# EAGLE schematic pcb_full (EAGLE 9.6.2)
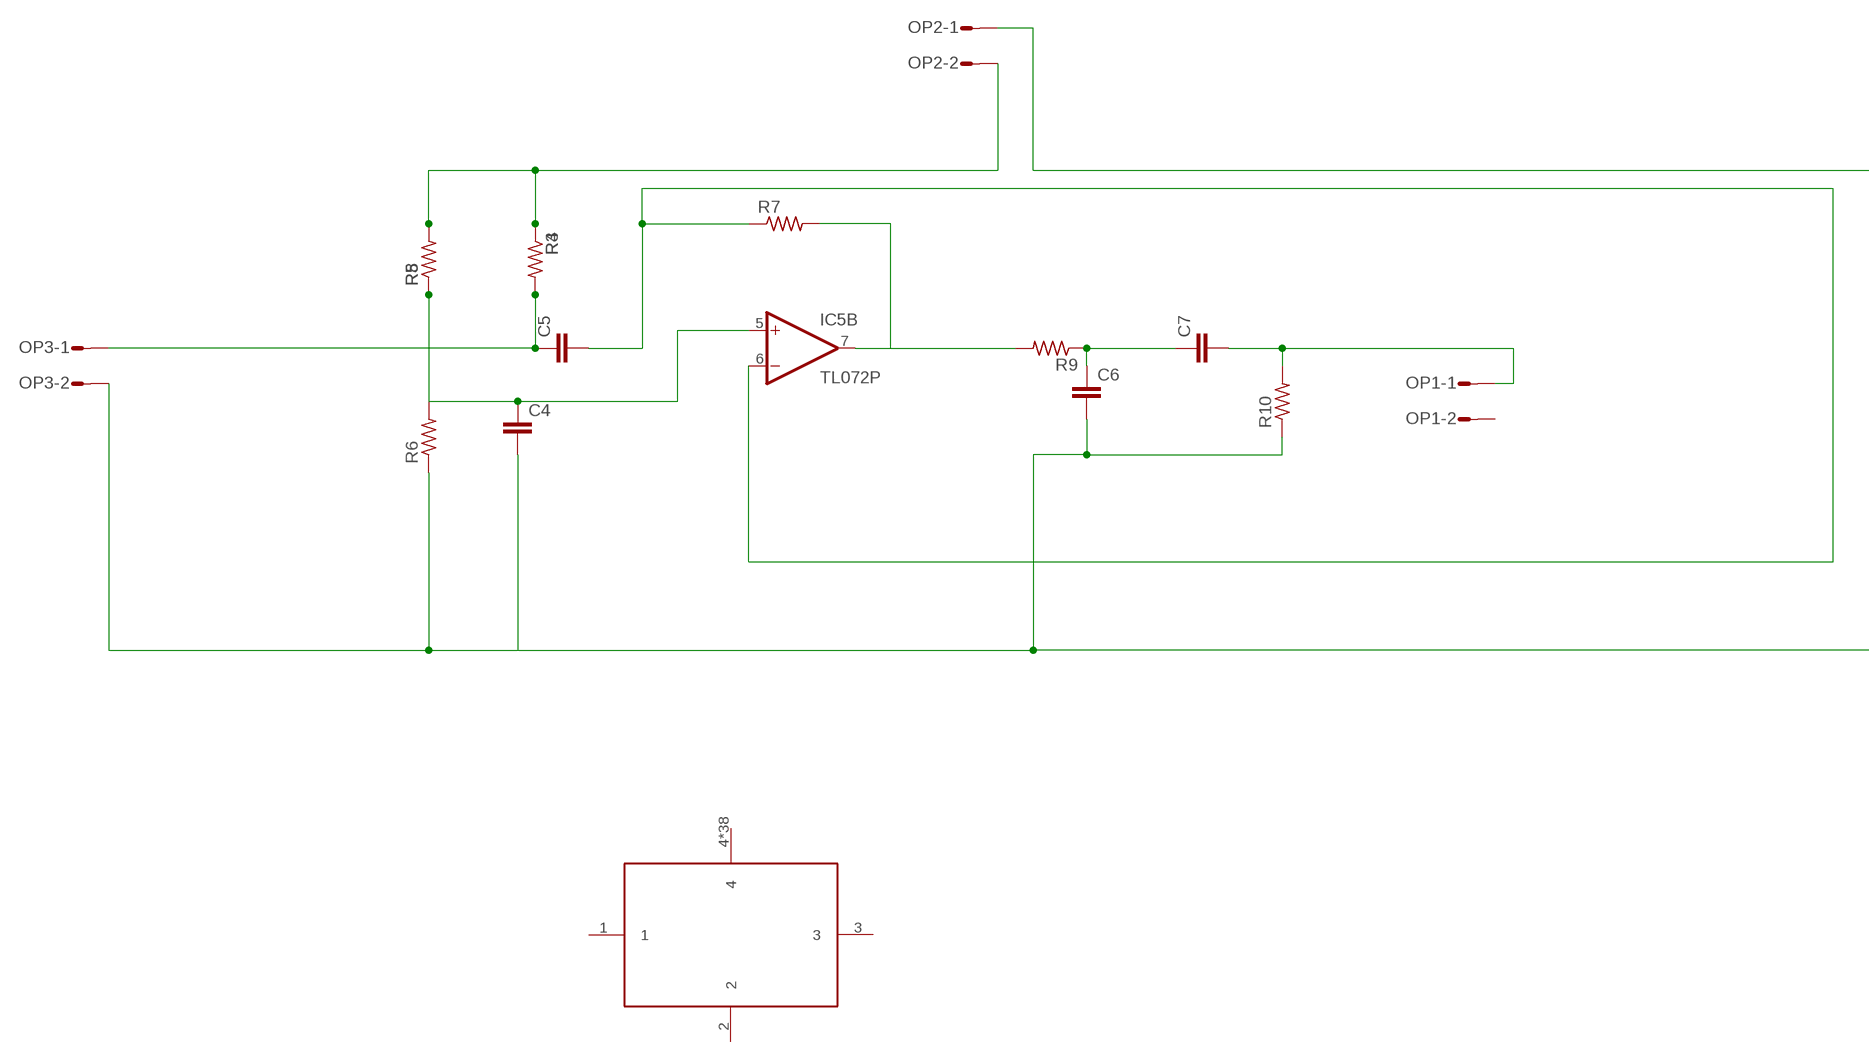
[diagram p0: schematic, sheet 1, part 1 of 2]
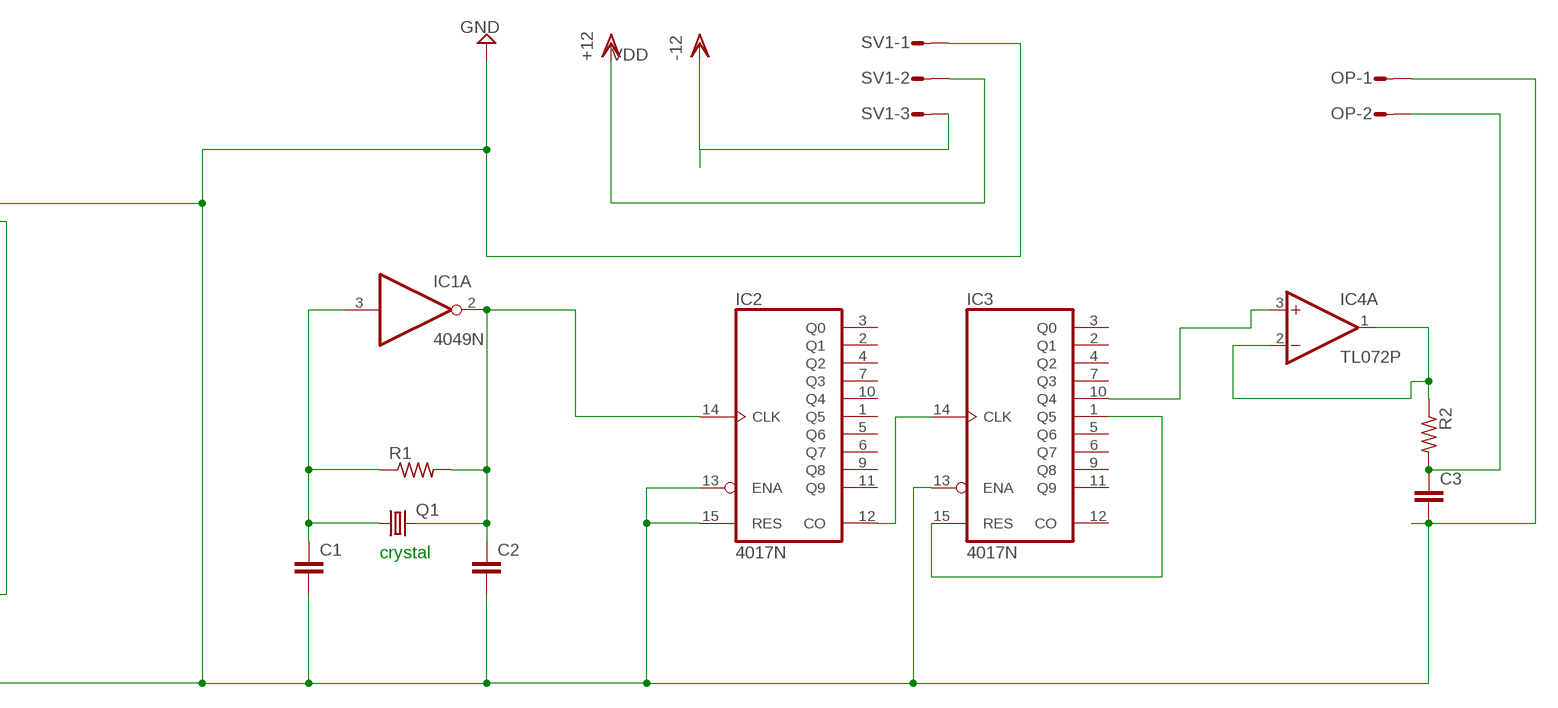
[diagram p1: schematic, sheet 1, part 2 of 2]

## Parts
C1  C5/3.5  [C5B3.5]
C2  C5/3.5  [C5B3.5]
C3  C5/3.5  [C5B3.5]
C4  C5/3.5  [C5B3.5]
C5  C5/3.5  [C5B3.5]
C6  C5/3.5  [C5B3.5]
C7  C5/3.5  [C5B3.5]
IC1  4049N  [DIL16]
IC2  4017N  [DIL16]
IC3  4017N  [DIL16]
IC4  TL072P  [DIL08]
IC5  TL072P  [DIL08]
OP  L02P  [L02P]
OP1  L02P  [L02P]
OP2  L02P  [L02P]
OP3  L02P  [L02P]
Q1  CRYSTALHC33U-V  [HC33U-V]
R1  R-US_0207/12  [0207/12]
R2  R-US_0207/12  [0207/12]
R3  R-US_0204/7  [0204/7]
R4  R-US_0204/7  [0204/7]
R5  R-US_0204/7  [0204/7]
R6  R-US_0204/7  [0204/7]
R7  R-US_0204/7  [0204/7]
R8  R-US_0204/7  [0204/7]
R9  R-US_0204/7  [0204/7]
R10  R-US_0204/7  [0204/7]
SV1  L03P  [L03P]
U$1  GROUP  [GROUP]

## Nets
GND: C1.2 C2.2 C3.2 C4.2 C6.2 IC2.13(ENA) IC2.15(RES) IC3.13(ENA) OP2.1 OP3.2 OP.1 R6.1 R10.1 SV1.1
GND1: C5.1 OP3.1 R3.2 R4.2
N$1: C1.1 IC1.3(A:I) Q1.1 R1.1
N$2: C2.1 IC1.2(A:O) IC2.14(CLK) Q1.2 R1.2
N$3: C3.1 OP.2 R2.2
N$4: IC3.1(Q5) IC3.15(RES)
N$5: IC3.10(Q4) IC4.3(A:+IN)
N$6: IC4.1(A:OUT) IC4.2(A:-IN) R2.1
N$7: C4.1 IC5.5(B:+IN) R5.1 R6.2 R8.1
N$8: IC2.12(CO) IC3.14(CLK)
N$10: OP2.2 R3.1 R4.1 R5.2 R8.2
N$11: C5.2 IC5.6(B:-IN) R7.1
N$12: C7.2 OP1.1 R10.2
N$13: IC5.7(B:OUT) R7.2 R9.2
N$14: C6.1 C7.1 R9.1
VDD: SV1.2 SV1.3 ; supply symbol labelled -12, +12
Unconnected: IC1.4(B:O) IC1.5(B:I) IC1.6(C:O) IC1.7(C:I) IC1.9(D:I) IC1.10(D:O) IC1.11(E:I) IC1.12(E:O) IC1.14(F:I) IC1.15(F:O) IC2.1(Q5) IC2.2(Q1) IC2.3(Q0) IC2.4(Q2) IC2.5(Q6) IC2.6(Q7) IC2.7(Q3) IC2.9(Q8) IC2.10(Q4) IC2.11(Q9) IC3.2(Q1) IC3.3(Q0) IC3.4(Q2) IC3.5(Q6) IC3.6(Q7) IC3.7(Q3) IC3.9(Q8) IC3.11(Q9) IC3.12(CO) IC4.5(B:+IN) IC4.6(B:-IN) IC4.7(B:OUT) IC5.1(A:OUT) IC5.2(A:-IN) IC5.3(A:+IN) OP1.2 U$1.1 U$1.2 U$1.3 U$1.4 U$1.P$1 U$1.P$2 U$1.P$3 U$1.P$4 U$1.P$5 U$1.P$6 U$1.P$7 U$1.P$8 U$1.P$9 U$1.P$10 U$1.P$11 U$1.P$12 U$1.P$13 U$1.P$14 U$1.P$15 U$1.P$16 U$1.P$17 U$1.P$18 U$1.P$19 U$1.P$20 U$1.P$21 U$1.P$22 U$1.P$23 U$1.P$24 U$1.P$25 U$1.P$26 U$1.P$27 U$1.P$28 U$1.P$29 U$1.P$30 U$1.P$31 U$1.P$32 U$1.P$33 U$1.P$34 U$1.P$35 U$1.P$36 U$1.P$37

## Notes on the sheet
- crystal

## Power pins joined to a net without a drawn wire
V+: IC4.8(P:V+) IC5.8(P:V+)
V-: IC4.4(P:V-) IC5.4(P:V-)
VDD: IC1.1(P:VDD) IC2.16(VDD) IC3.16(VDD)
VSS: IC1.8(P:VSS) IC2.8(VSS) IC3.8(VSS)

## Library data of the parts
C1-C7 = capacitor-wima:C: CAPACITOR naming: grid - package width
IC1 = 40xx:4049: Hex inverting BUFFER
IC2 IC3 = 40xx:4017: COUNTER/DIVIDER
IC4 IC5 = linear:TL072: OP AMP
OP OP1-OP3 = con-amp-mt:L02P: AMP MT CONNECTOR; OC_FARNELL: unknown; OC_NEWARK: unknown
Q1 = crystal:CRYSTAL: CRYSTAL; OC_FARNELL: unknown; OC_NEWARK: unknown
R1-R10 = rcl:R-US_: RESISTOR, American symbol; SPICEPREFIX: R
SV1 = con-amp-mt:L03P: AMP MT CONNECTOR; OC_FARNELL: unknown; OC_NEWARK: unknown
U$1 = Group22:GROUP